# Altium schematic sheet SIH.SchDoc
size A4; SheetNumber: 1; SheetTotal: 1
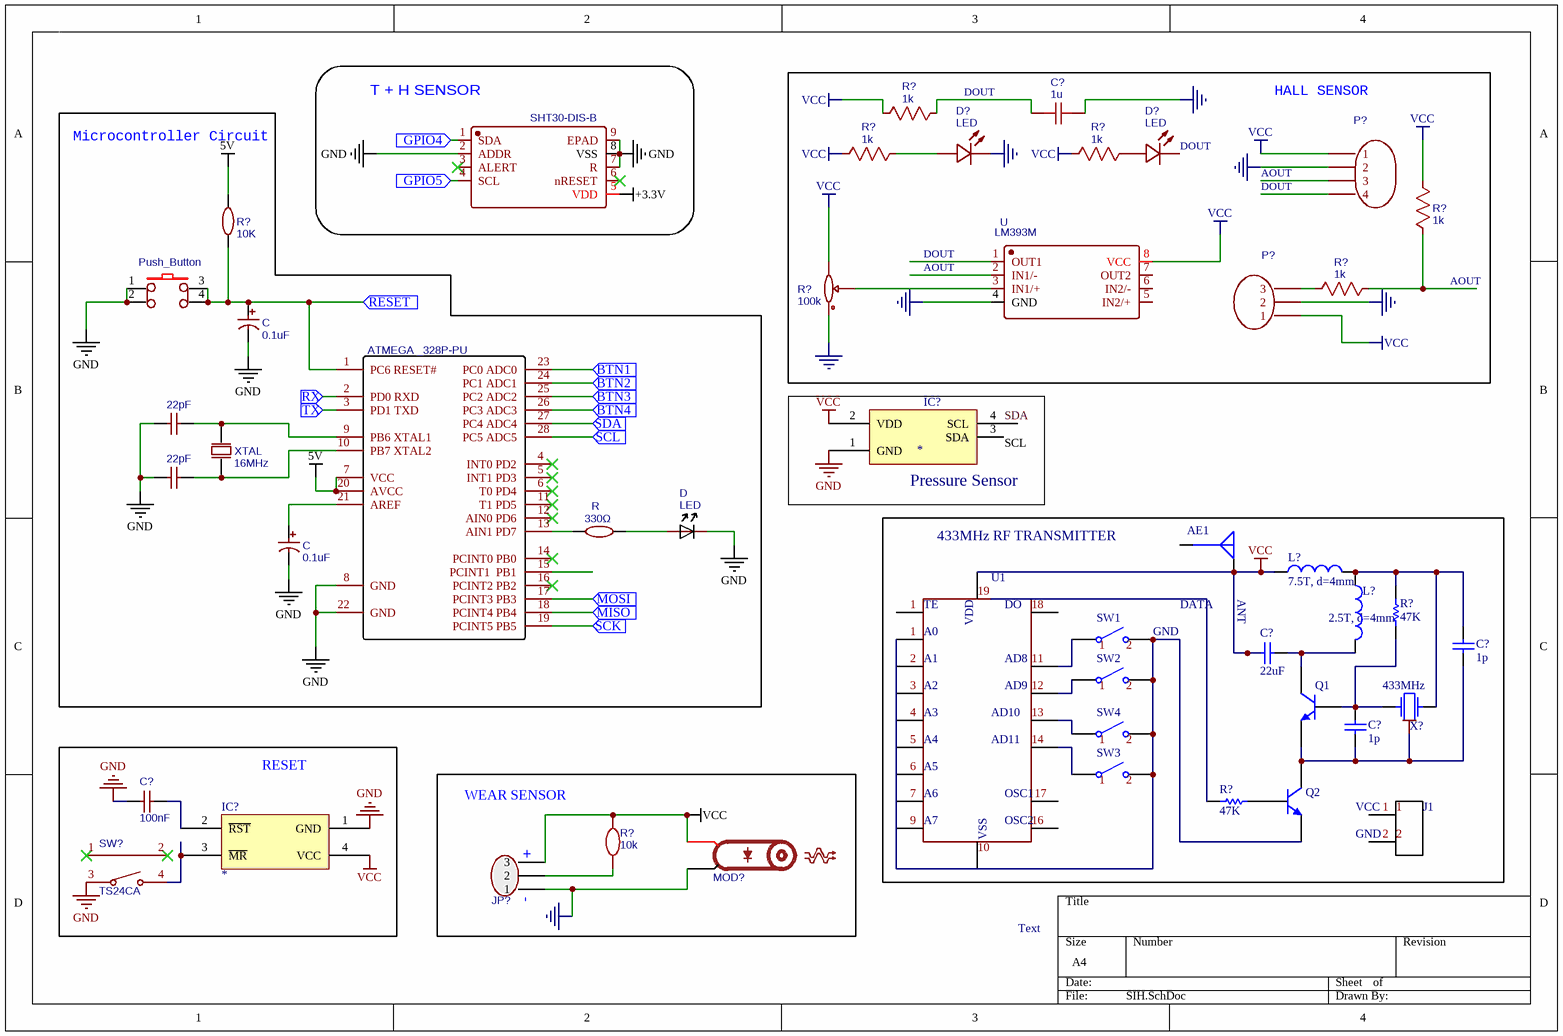
[diagram p0: SIH.SchDoc]

## Parts
(Parts that share a designator on the sheet are numbered #1, #2 ... from top to bottom, then left to right.)
?#1  SHT30-DIS-B  [DFN-8_L2.5-W2.5-P0.50-BL-EP]
?#2  Push_Button  [KEY-TH_4P-L6.0-W6.0-P4.50]
?#3  22pF  [CAP-TH_L3.5-W3.0-P2.54-D0.8]
?#4  22pF  [CAP-TH_L3.5-W3.0-P2.54-D0.8]
AE1  (no value)
C#1  0.1uF  [CAP-TH_BD5.0-P2.00-D0.8-FD]
C#2  0.1uF  [CAP-TH_BD5.0-P2.00-D0.8-FD]
C?#1  1u  [C0805]
C?#2  value 22uF  (hidden comment: Capacitor)
C?#3  value 1p  (hidden comment: Capacitor)
C?#4  value 1p  (hidden comment: Capacitor)
C?#5  100nF  [C0805]
D  LED  [5MM LED]
D?#1  LED  [LED3MM]
D?#2  LED  [LED3MM]
IC?#1  *
IC?#2  *
JP?  Header-MALE-2.54_1x3  [HDR-3X1/2.54-90°]  (value not drawn)
L?#1  value 7.5T, d=4mm  (hidden comment: Inductor)
L?#2  value 2.5T, d=4mm  (hidden comment: Inductor)
MOD?  LASER_MODULE  [LASER_MODULE]  (value not drawn)
P?#1  SIP4  [HDR1X4]  (value not drawn)
P?#2  SIP3  [HDR1X3]  (value not drawn)
Q1  Bipolar NPN 3 Pins Transistor Gummel-Poon Model  (value not drawn)
Q2  Bipolar NPN 3 Pins Transistor Gummel-Poon Model  (value not drawn)
R  330Ω  [AXIAL-0.4]
R?#1  1k  [C0805]
R?#2  1k  [C0805]
R?#3  1k  [C0805]
R?#4  1k  [C0805]
R?#5  10K  [AXIAL-0.4]
R?#6  100k  [TRIM_POT_PTH]
R?#7  1k  [C0805]
R?#8  value 47K  (hidden comment: Resistor)
R?#9  value 47K  (hidden comment: Resistor)
R?#10  10k  [R0603]
SW1  Single-Pole, Single-Throw Switch  (value not drawn)
SW2  Single-Pole, Single-Throw Switch  (value not drawn)
SW3  Single-Pole, Single-Throw Switch  (value not drawn)
SW4  Single-Pole, Single-Throw Switch  (value not drawn)
SW?  TS24CA  [SW-SMD_TS24CA]
U  LM393M  [SOIC-8]
U?  ATMEGA _328P-PU  [DIP-28_L34.6-W7.3-P2.54-LS10.2-BL]
X?  F0: 433MHz  (hidden comment: Crystal)
XTAL  16MHz  [16MHZ_OSC [PCB]]

## Blocks framed on the sheet
T + H SENSOR: ?#1
HALL SENSOR: C?#1 D?#1 D?#2 P?#1 P?#2 R?#1-R?#4 R?#6 R?#7 U
Microcontroller Circuit: ?#2-?#4 C#1 C#2 D R R?#5 U? XTAL
Pressure Sensor: IC?#1
433MHz RF TRANSMITTER: AE1 C?#2-C?#4 L?#1 L?#2 Q1 Q2 R?#8 R?#9 SW1-SW4 X?
RESET: C?#5 IC?#2 SW?

## Ports
BTN1 (in), BTN2 (in), BTN3 (in), BTN4 (in), GPIO4 (in), GPIO5 (in), MISO (in), MOSI (in), RESET (in), RX (in), SCK (in), SCL (in), SDA (in), TX (in)

## Nets
5V: R?#5.2 U?.7(VCC) U?.20(AVCC)
+3.3V: ?#1.5(VDD)
GND: ?#1.2(ADDR) ?#1.7(R) ?#1.8(VSS) ?#1.9(EPAD) ?#2.1 ?#2.2 ?#3.2 ?#4.2 C#1.2 C#2.2 C?#1.2 C?#5.2 D.2 D?#1.K IC?#1.1(GND) IC?#2.1(GND) JP?.1 MOD?.1(C) P?#1.2 P?#2.2 R?#6.3 SW?.3 U.4(GND) U?.8(GND) U?.22(GND)
NetC?#3_1: C?#3.1 C?#4.1 Q1.3(E) Q2.1(C)
VCC: AE1.G C?#2.1 IC?#1.2(VDD) IC?#2.4(VCC) JP?.3 L?#1.1 MOD?.3(A) P?#1.1 P?#2.1 R?#1.1 R?#2.2 R?#3.2 R?#4.2 R?#6.1 R?#10.1 U.8(VCC)
AOUT: P?#1.3 R?#4.1 R?#7.2 U.2(IN1/-)
BTN1: U?.23(PC0_ADC0) ; port BTN1
BTN2: U?.24(PC1_ADC1) ; port BTN2
BTN3: U?.25(PC2_ADC2) ; port BTN3
BTN4: U?.26(PC3_ADC3) ; port BTN4
DOUT: C?#1.1 D?#2.K P?#1.4 R?#1.2 U.1(OUT1)
GPIO4: ?#1.1(SDA) ; port GPIO4
GPIO5: ?#1.4(SCL) ; port GPIO5
MISO: U?.18(PCINT4_PB4) ; port MISO
MOSI: U?.17(PCINT3_PB3) ; port MOSI
RESET: ?#2.3 ?#2.4 C#1.1 R?#5.1 U?.1(PC6_RESET#) ; port RESET
RX: U?.2(PD0_RXD) ; port RX
SCK: U?.19(PCINT5_PB5) ; port SCK
SCL: U?.28(PC5_ADC5) ; port SCL
SDA: U?.27(PC4_ADC4) ; port SDA
TX: U?.3(PD1_TXD) ; port TX
Net?#3_1: ?#3.1 U?.9(PB6_XTAL1) XTAL.1(OSC1)
Net?#4_1: ?#4.1 U?.10(PB7_XTAL2) XTAL.2(OSC2)
NetC#2_1: C#2.1 U?.21(AREF)
NetC?#2_2: C?#2.2 L?#2.2 Q1.1(C)
NetC?#3_2: C?#3.2 L?#1.2 L?#2.1 R?#8.2 X?.2
NetC?#4_2: C?#4.2 Q1.2(B) R?#8.1 X?.1
NetC?#5_1: C?#5.1 IC?#2.2(~{RST})
NetD?#1_A: D?#1.A R?#2.1
NetD?#2_A: D?#2.A R?#3.1
NetD_1: D.1 R.2
NetIC?#2_3: IC?#2.3(~{MR}) SW?.4
NetJP?_2: JP?.2 R?#10.2
NetP?#2_3: P?#2.3 R?#7.1
NetQ2_2: Q2.2(B) R?#9.2
NetQ2_3: Q2.3(E) SW1.2 SW2.2 SW3.2 SW4.2
NetR?#6_2: R?#6.2 U.3(IN1/+)
NetR_1: R.1 U?.13(AIN1_PD7)

Not connected (* = marked no-connect by the designer): ?#1 3(ALERT)* 6(nRESET)*; AE1 S; IC?#1 3(SDA) 4(SCL); R?#9 1; SW1 1; SW2 1; SW3 1; SW4 1; SW? 1* 2*; U 5(IN2/+) 6(IN2/-) 7(OUT2); U? 4(INT0_PD2)* 5(INT1_PD3)* 6(T0_PD4)* 11(T1_PD5)* 12(AIN0_PD6)* 14(PCINT0_PB0)* 15(PCINT1__PB1) 16(PCINT2_PB2)*

## Notes on the sheet
- (near IC?#1) SCL
- (near IC?#1) SDA
- U1
- 1
- TE
- A0
- VDD
- 19
- DO
- 18
- (near SW1) 1
- (near SW1) 2
- (near SW1) GND
- DATA
- ANT
- 2
- 3
- 4
- A1
- A2
- A3
- AD10
- AD9
- AD8
- 11
- 12
- 13
- (near SW2) 1
- (near SW2) 2
- 5
- 6
- A4
- A5
- AD11
- 14
- (near SW4) 1
- (near SW3) 1
- (near SW4) 2
- (near SW3) 2
- WEAR SENSOR
- (near JP?) +
- 7
- 9
- A6
- A7
- 10
- VSS
- OSC2
- OSC1
- 16
- 17
- VCC
- GND
- J1
- (near JP?) -
- Text

## Library data of the parts
?#1 = SHT30-DIS-B: Manufacturer: Sensirion; Supplier: LCSC; Manufacturer Part: SHT30-DIS-B; Supplier Part: C77361; JLCPCB Part Class: Extended Part; spicePre: U; spiceSymbolName: SHT30-DIS-B
?#2 = Push_Button: Manufacturer: ReliaPro; Manufacturer Part: button6*6*8.5; Supplier Part: C59980; Supplier: LCSC; image: http://image.lceda.cn/szlcsc/C59980.jpg; spicePre: S; spiceSymbolName: Push_Button
?#3 ?#4 = 22pF: Manufacturer: ReliaPro; Manufacturer Part: 22pf/50V 10%; nameAlias: Capacitance; Supplier: LCSC; Supplier Part: C9316; spicePre: C; spiceSymbolName: 22pF
AE1 = Basic Antenna
C#1 C#2 = 0.1uF: Manufacturer: ValuePro; Manufacturer Part: 0.1UF 50V; nameAlias: Capacitance; Supplier: LCSC; Supplier Part: C28061; JLCPCB Part Class: Extended Part; spicePre: C; spiceSymbolName: 0.1uF
C?#1 = 1u: nameAlias: Value(F); Manufacturer Part: ?; spicePre: C; spiceSymbolName: Capacitor
C?#2-C?#4 = Capacitor: SimulationGenericComponent: True
C?#5 = 100nF: Manufacturer: FH; Manufacturer Part: 0805B104K500NT; nameAlias: Capacitance; Supplier: LCSC; Supplier Part: C38141; spicePre: C; spiceSymbolName: 0805B104K500NT
D = LED: Contributor: Axbri; Manufacturer Part: 5mm LED; spicePre: D; spiceSymbolName: LED
D?#1 D?#2 = LED: nameAlias: Model; Manufacturer Part: ?; spicePre: D; spiceSymbolName: LED
IC?#1 = MEAS SPEC MS5611
IC?#2 = MICROCHIP MIC811
JP? = Header-MALE-2.54_1x3: Manufacturer Part: New SchematicLib; Contributor: adrirobot; spicePre: J; spiceSymbolName: Header-MALE-2.54_1x3
L?#1 L?#2 = Inductor: SimulationGenericComponent: True
MOD? = LASER_MODULE: Contributor: adrirobot; Manufacturer Part: ?; spicePre: M
P?#1 = SIP4: catid: 20; Manufacturer Part: ?; spicePre: P
P?#2 = SIP3: catid: 20; Manufacturer Part: ?; spicePre: P
Q1 Q2 = BJT NPN_GP: SimulationGenericComponent: True; BF: 100; AF: 0; BR: 1; EG: 1.11; FC: 0.5; IS: 1e-16; MJC: 0.33; NC: 2; NE: 1.5; TNOM: 27; VBC_MAX: 1e99; VJC: 0.75; XTI: 3; CJC: 0; CJE: 0; CJS: 0; CTC: 0; CTE: 0; CTS: 0; IKF: 0; IKR: 0; IRB: 0; ISC: 0; ISE: 0; ISS: 0; ITF: 0; KF: 0; MJE: 0.33; MJS: 0; NF: 1; NKF: 0.5; NR: 1; NS: 1; PTF: 0; RB: 0; RBM: 0; RC: 0; RE: 0; SUBS: 1; TBF1: 0; TBF2: 0; TBR1: 0; TBR2: 0; TF: 0; TIKF1: 0; TIKF2: 0; TIKR1: 0; TIKR2: 0; TIRB1: 0; TIRB2: 0; TIS1: 0; TIS2: 0; TISC1: 0; TISC2: 0; TISE1: 0; TISE2: 0; TITF1: 0; TITF2: 0; TLEV: 0; TLEVC: 0; TMJC1: 0; TMJC2: 0; TMJE1: 0; TMJE2: 0; TMJS1: 0; TMJS2: 0; TNC1: 0; TNC2: 0; TNE1: 0; TNE2: 0; TNF1: 0; TNF2: 0; TNR1: 0; TNR2: 0; TNS1: 0; TNS2: 0; TR: 0; TRB1: 0; TRB2: 0; TRC1: 0; TRC2: 0; TRE1: 0; TRE2: 0; TRM1: 0; TRM2: 0; TTF1: 0; TTF2: 0; TTR1: 0; TTR2: 0; TVAF1: 0; TVAF2: 0; TVAR1: 0; TVAR2: 0; TVJC: 0; TVJE: 0; TVJS: 0; VAF: 0; VAR: 0; VBE_MAX: 1e99; VCE_MAX: 1e99; VJE: 0.75; VJS: 0.75; VTF: 0; XCJC: 1; XTB: 0; XTF: 0
R = 330Ω: Manufacturer: UniOhm; Manufacturer Part: MFR0W4F2200A50; Power: 1/4W; Tolerance: ±1%; EasyEDA: E57439; Value: Value; Supplier Part: E57439; Supplier: LCSC; spicePre: R; spiceSymbolName: RESISTOR
R?#1-R?#4 R?#7 = 1k: nameAlias: Value(Ω); Manufacturer Part: ?; spicePre: R; spiceSymbolName: Resistor
R?#5 = 10K: Manufacturer: UniOhm; Manufacturer Part: MFR0W4F2200A50; Power: 1/4W; Tolerance: ±1%; EasyEDA: E57439; Value: Value; Supplier Part: E57439; Supplier: LCSC; spicePre: R; spiceSymbolName: RESISTOR
R?#6 = 100k: nameAlias: Value(Ω); Model: Potentiometer; K(%): 50; spicePre: X; Manufacturer Part: ?; spiceSymbolName: Potentiometer
R?#8 R?#9 = Resistor: TC1: 0; SimulationGenericComponent: True; TC2: 0
R?#10 = 10k: nameAlias: Value(Ω); Contributor: LCEDA_Lib; spicePre: R; spiceSymbolName: R_0603_EU
SW1-SW4 = SPST SW: closed: 0; Rclosed: 1m; Ropen: 1Meg; SimulationGenericComponent: True
SW? = TS24CA: Manufacturer: SHOU HAN; Contributor: LCSC; Supplier: LCSC; Supplier Part: C393942; Manufacturer Part: TS24CA; JLCPCB Part Class: Extended Part; spicePre: S; spiceSymbolName: TS24CA
U = LM393M: sourceId: lJjECAywu; spicePre: X; Manufacturer Part: ?
U? = ATMEGA _328P-PU: Manufacturer: MICROCHIP; Manufacturer Part: ATMEGA328P-PU; sourceId: Oic6oiASL; Contributor: LCSC; timeStamp: 1451725987; Supplier: LCSC; image: //image.lceda.cn/szlcsc/C33901.jpg; Supplier Part: C33901; spicePre: U; spiceSymbolName: ATMEGA _328P-PU
X? = Crystal: R: 500; Q: 50K; SimulationGenericComponent: True
XTAL = 16MHz: Manufacturer: SHIVRAM; Manufacturer Part: 0SC-16MHz; nameAlias: Frequency; Contributor: Mantas Petrauskas; Supplier: SHIVRAM; Supplier Part: 0SC-16MHz; spicePre: X; spiceSymbolName: Oscillator